# EasyEDA Pro project ProPrj_CyMouse.epro, board 主板
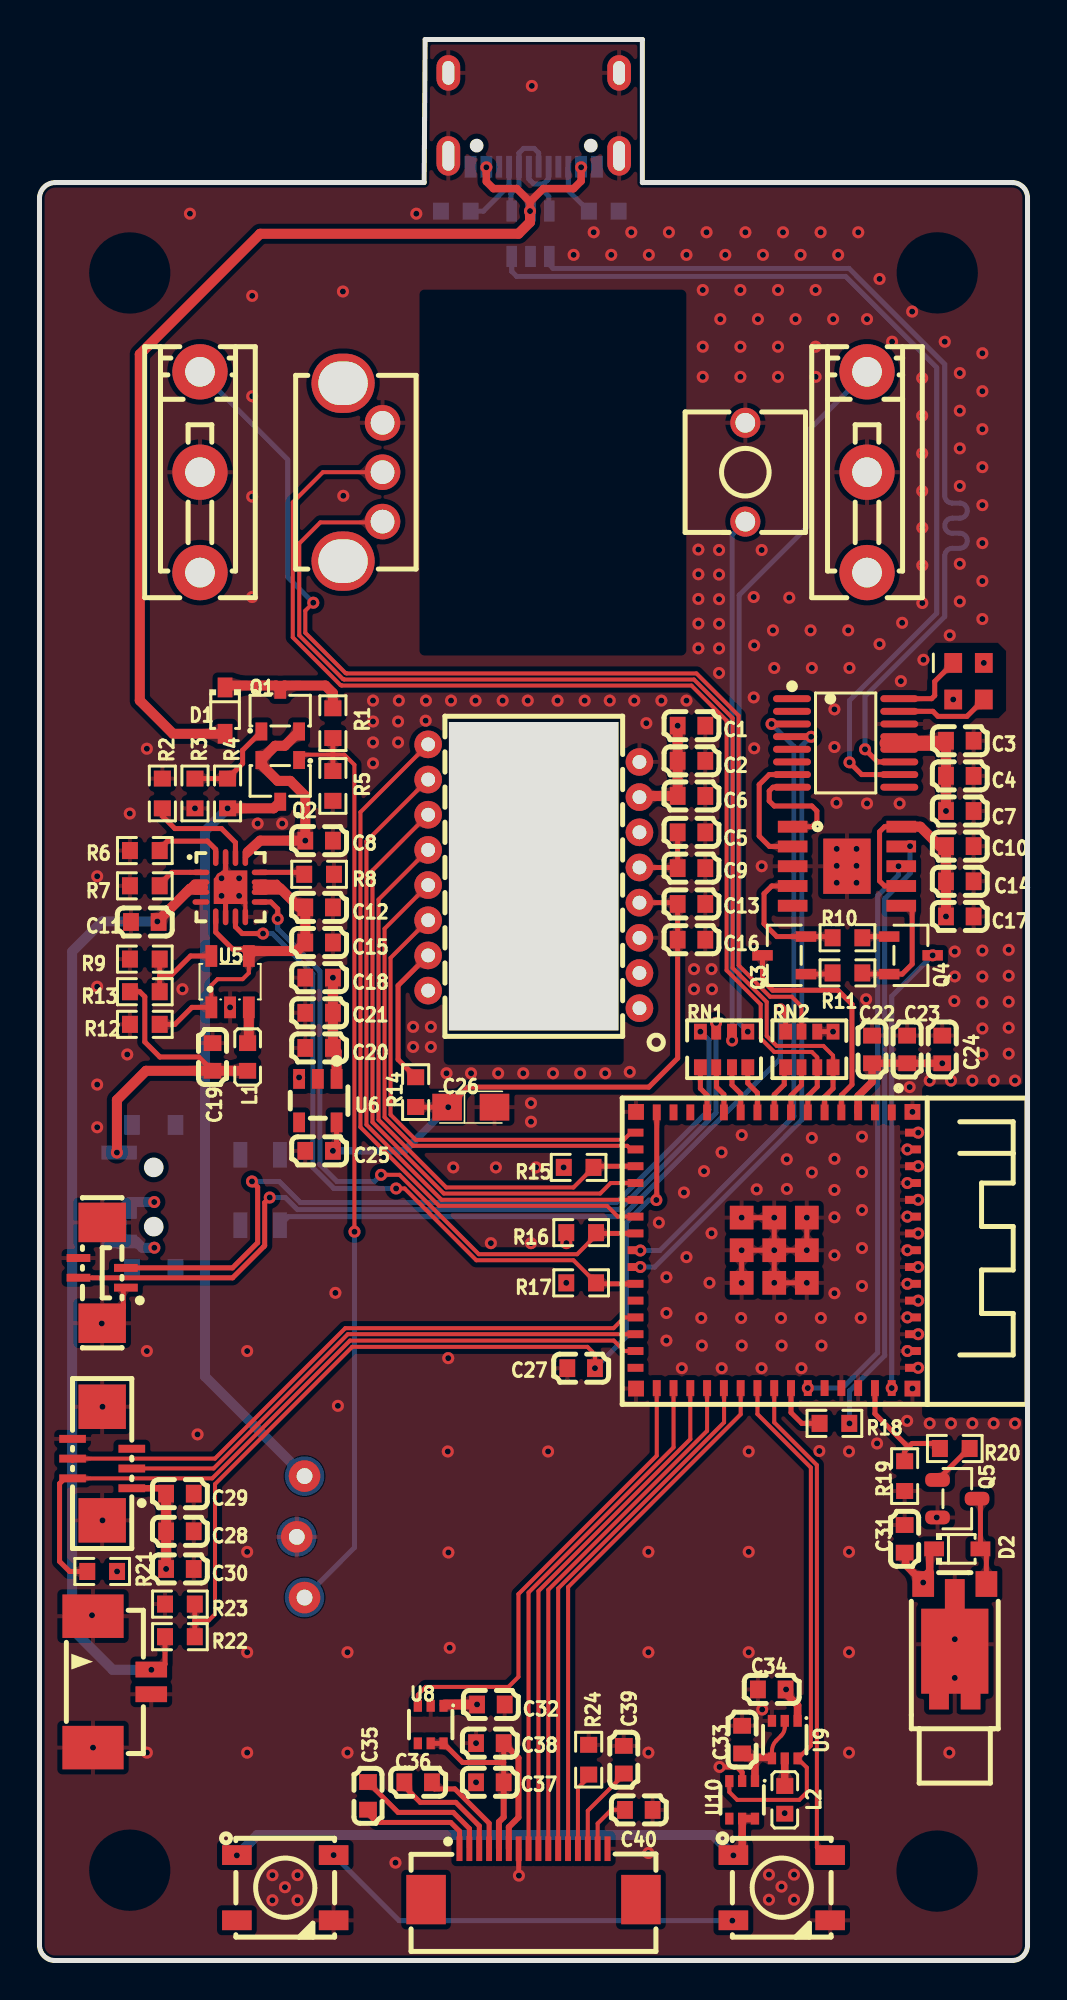
[diagram p7: board, top side]
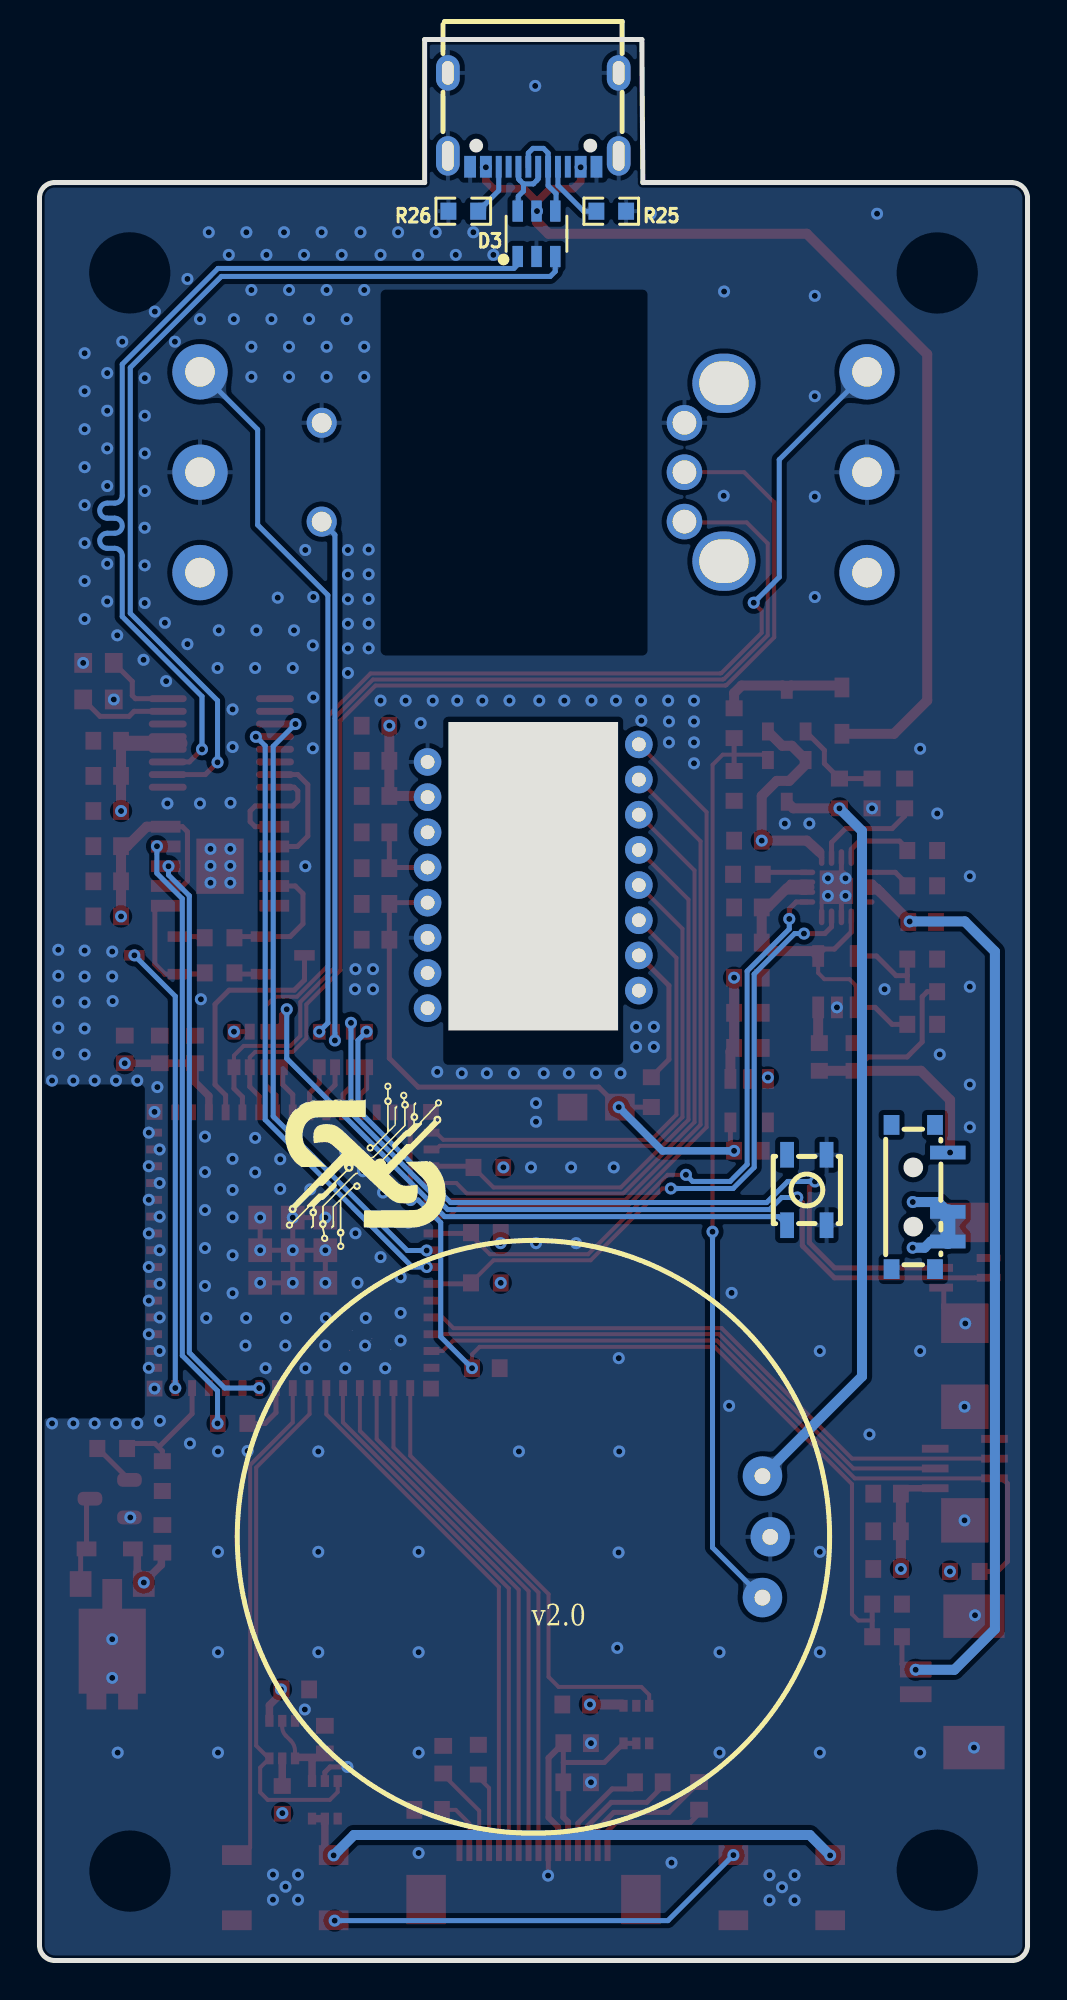
[diagram p8: board, bottom side, seen from below]

Outline 50.04 x 97.21 mm; copper layers: Top Layer, Inner1, Inner2, Bottom Layer. Coordinates in mm from the lower left corner of the outline.
Outline path: 0,89.2 arc(0.24,89.74) 0.79,89.97 19.48,89.97 19.53,97.21 30.53,97.21 30.53,89.97 49.28,89.97 arc(49.81,89.74) 50.04,89.2 50.04,0.76 arc(49.81,0.22) 49.27,0 0.78,0 arc(0.23,0.22) 0,0.76 0,89.2
Stack: Top Layer 0.035mm 外层铜厚1oz / Dielectric1 0.2104mm 7628 RC49% 8.6mil / Inner1 0.0152mm 内层铜厚 / Dielectric2 1.065mm 1.1mm H/HOZ Copper / Inner2 0.0152mm 内层铜厚 / Dielectric3 0.2104mm 7628 RC49% 8.6mil / Bottom Layer 0.035mm 外层铜厚1oz

## Design rules (mm)
net UD+: USB_PORT
net UD-: USB_PORT
net USB_D+: USB_MCU
net USB_D-: USB_MCU
net D3+: D3
net D3-: D3
template: 自定义配置
spacing copperThickness1oz (default): track to track 0.102, other pairs 0.152 to 0.3
spacing copperThickness2oz: track to track 0.203, other pairs 0.152 to 0.3
track width copperThickness1oz (default): min 0.127, default 0.254, max 2.54
track width copperThickness2oz: min 0.203, default 0.254, max 2.54
differential pair differentialPair (default): width min 0.127, default 0.254, max 2.54; gap min 0.152, default 0.152
via viaSize (default): diameter min 0.5, default 0.61, max 10; hole min 0.3, default 0.305, max 6.3

## Placement (name value [footprint] x y rotation side)
C1  10uF  [C0603]  33.02 62.48 180 top
C2  1uF  [C0603]  33.02 60.71 180 top
C3  100nF  [C0603]  46.61 61.72 0 top
C4  1uF  [C0603]  46.61 59.94 0 top
C5  4.7uF  [C0603]  33.02 57.08 180 top
C6  100nF  [C0603]  33.02 58.93 180 top
C7  10uF  [C0603]  46.61 58.17 0 top
C8  1uF  [C0603]  14.16 56.67 0 top
C9  100nF  [C0603]  33.02 55.27 180 top
C10  100nF  [C0603]  46.61 56.39 0 top
C11  4.7uF  [C0603]  5.33 52.55 0 top
C12  4.7uF  [C0603]  14.16 53.29 180 top
C13  100nF  [C0603]  33.02 53.46 180 top
C14  1uF  [C0603]  46.61 54.61 0 top
C15  4.7uF  [C0603]  14.16 51.51 180 top
C16  10uF  [C0603]  33.02 51.65 180 top
C17  10uF  [C0603]  46.61 52.83 0 top
C18  10uF  [C0603]  14.16 49.73 0 top
C19  10uF  [C0603]  8.76 45.72 270 top
C20  100nF  [C0603]  14.16 46.18 0 top
C21  1uF  [C0603]  14.16 47.95 0 top
C22  100nF  [C0603]  42.16 46.1 270 top
C23  1uF  [C0603]  43.94 46.1 270 top
C24  10uF  [C0603]  45.72 46.1 270 top
C25  1uF  [C0603]  14.16 40.97 0 top
C26  47uF  [CASE-A_3216]  21.84 43.18 0 top
C27  100nF  [C0603]  27.43 29.97 0 top
C28  1uF  [C0603]  7.11 21.72 180 top
C29  100nF  [C0603]  7.11 23.62 180 top
C30  10uF  [C0603]  7.11 19.81 180 top
C31  100nF  [C0603]  43.81 21.34 90 top
C32  1uF  [C0603]  22.86 12.95 180 top
C33  10uF  [C0603]  35.59 11.18 270 top
C34  10uF  [C0603]  37.08 13.72 0 top
C35  1uF  [C0603]  16.64 8.33 270 top
C36  1uF  [C0603]  19.18 9.02 180 top
C37  1uF  [C0603]  22.81 9.02 0 top
C38  1uF  [C0603]  22.81 11 0 top
C39  4.7uF  [C0603]  29.59 10.16 270 top
C40  4.7uF  [C0603]  30.35 7.62 180 top
CN1  WAFER-MX1.25-2PLB  [CONN-SMD_P1.25_M1250VS-02P]  4.19 14.1 270 top
D1  CUS10S30,H3F  [SOD-323_L1.8-W1.3-LS2.5-RD]  9.4 63.25 270 top
D2  CUS10S30,H3F  [SOD-323_L1.8-W1.3-LS2.5-RD]  46.48 20.83 0 top
D3  USBLC6-2SC6  [SOT-23-6_L2.9-W1.6-P0.95-LS2.8-BL]  24.87 87.38 180 bottom
DPI1  TS3315A  [SW-SMD_4P-L3.4-W3.4-P2.00-LS4.0]  11.18 38.99 270 bottom
FPC1  X05C2004TZ-518  [FPC-SMD_4P-P0.50_X05C2004TZ]  3.18 34.8 90 top
FPC2  AFC11-S06ICA-00  [FPC-SMD_6P-P0.50_AFC11-S06ICA-00]  3.18 25.15 90 top
FPC3  FPC-05F-16PH20  [FPC-SMD_16P-P0.50_FPC-05F-16PH20]  25.02 4.37 0 top
L1  2.2uH  [L0603]  10.54 45.72 90 top
L2  4.7uH  [L0603]  37.74 8.13 90 top
LED1  WS2812B-B/T  [LED-SMD_4P-L5.0-W5.0-TL_WS2812B-B]  12.45 3.68 0 top
LED2  WS2812B-B/T  [LED-SMD_4P-L5.0-W5.0-TL_WS2812B-B]  37.59 3.68 0 top
M1  Z3OC1T8219731  [VIBRATING-MOTOR-SMD_3P-C9900001680]  46.36 17.53 90 top
NOREF  -  [Pad_e18789]  13.42 24.51 0 top
NOREF#2  -  [Pad_e18779]  13.03 21.44 0 top
NOREF#3  -  [Pad_e18788]  13.42 18.36 0 top
Q1  AO3401  [SOT-23-3_L2.9-W1.4-P1.90-LS2.6-BR]  12.19 63.25 270 top
Q2  AO3401  [SOT-23-3_L2.9-W1.4-P1.90-LS2.6-BR]  12.19 59.69 90 top
Q3  S8050 J3Y(RANGE:200-350)  [SOT-23-3_L3.0-W1.7-P0.95-LS2.9-BR]  37.72 50.86 0 top
Q4  S8050 J3Y(RANGE:200-350)  [SOT-23-3_L3.0-W1.7-P0.95-LS2.9-BR]  44.13 50.86 180 top
Q5  AO3400A  [SOT-23-3_L2.9-W1.3-P1.90-LS2.4-BR]  46.48 23.37 180 top
R1  5.1kΩ  [R0603]  14.86 62.61 90 top
R2  47kΩ  [R0603]  6.22 59.05 270 top
R3  100kΩ  [R0603]  7.87 59.05 90 top
R4  5.1kΩ  [R0603]  9.53 59.05 270 top
R5  100kΩ  [R0603]  14.86 59.44 90 top
R6  1.2kΩ  [R0603]  5.33 56.17 180 top
R7  10kΩ  [R0603]  5.33 54.38 0 top
R8  1.2kΩ  [R0603]  14.16 54.96 180 top
R9  100kΩ  [R0603]  5.33 50.67 0 top
R10  4.7kΩ  [R0603]  40.92 51.75 0 top
R11  4.7kΩ  [R0603]  40.92 49.97 180 top
R12  499kΩ  [R0603]  5.33 47.37 0 top
R13  453kΩ  [R0603]  5.33 49.02 180 top
R14  5.6Ω  [R0603]  19.05 43.94 270 top
R15  10kΩ  [R0603]  27.31 40.13 180 top
R16  10kΩ  [R0603]  27.43 36.83 0 top
R17  10kΩ  [R0603]  27.43 34.29 0 top
R18  470Ω  [R0603]  40.26 27.18 180 top
R19  100kΩ  [R0603]  43.81 24.51 90 top
R20  470Ω  [R0603]  46.36 25.91 0 top
R21  100kΩ  [R0603]  3.18 19.69 180 top
R22  300kΩ  [R0603]  7.11 16.38 180 top
R23  300kΩ  [R0603]  7.11 18.03 0 top
R24  390kΩ  [R0603]  27.81 10.16 270 top
R25  5.1kΩ  [R0603]  21.08 88.52 180 bottom
R26  5.1kΩ  [R0603]  28.58 88.52 0 bottom
RN1  10kΩ  [RES-ARRAY-SMD_0603-8P-L3.2-W1.6-BL]  34.67 46.1 0 top
RN2  10kΩ  [RES-ARRAY-SMD_0603-8P-L3.2-W1.6-BL]  38.99 46.1 0 top
SW1  K9-1267T  [SW-TH_K9-1267T]  8.13 75.31 90 top
SW2  EC10E1220501  [SW-TH_EC10EXXXXXXX]  16.37 75.31 90 top
SW3  CMI621101D01  [SW-TH_L6.2-W6.2-P5.00]  35.75 75.31 270 top
SW4  K9-1267T  [SW-TH_K9-1267T]  41.91 75.31 90 top
TP1  -  [Test-Point-0.5mm]  13.42 24.51 0 top
TP2  -  [Test-Point-0.5mm]  13.03 21.44 0 top
TP3  -  [Test-Point-0.5mm]  13.42 18.36 0 top
U1  CH334R  [QSOP-16_L4.9-W3.9-P0.64-LS6.0-BL]  40.83 61.61 270 top
U2  BQ24073RGTR  [QFN-16_L3.0-W3.0-P0.50-TL-EP1.7]  9.68 54.31 0 top
U3  PAW3395DM-T6QU  [DIP-16_PAW3395DM-T6QU]  25.03 54.86 180 top
U4  CH340K  [ESOP-10_L4.9-W3.9-P1.00-LS6.2-BL-EP]  40.89 55.37 270 top
U5  TLV62569DBVR  [SOT-23-5_L3.0-W1.7-P0.95-LS2.8-BR]  9.65 49.53 270 top
U6  TLV70019DDCR  [SOT-23-5_L2.9-W1.6-P0.95-LS2.8-BR]  14.1 43.51 90 top
U7  ESP32-S3-MINI-1-N4R2  [BULETM-SMD_ESP32-S3-MINI-1-N8]  37.21 35.94 270 top
U8  TPS22919QDCKRQ1  [SC-70-6_L2.0-W1.3-P0.65-LS2.1-BR]  19.81 11.94 90 top
U9  TPS61222DCKR  [SC-70-6_L2.2-W1.3-P0.65-LS2.1-BR]  37.74 11.18 90 top
U10  TPS22919QDCKRQ1  [SC-70-6_L2.0-W1.3-P0.65-LS2.1-BR]  35.59 8.13 90 top
U11  MSS12C02LS-BB2.0  [SW-SMD_MSS12C02LS-HB2.0-1]  5.46 38.63 90 bottom
USB1  TYPE-C 16PIN 2MD(073)  [USB-C-SMD_TYPE-C-6PIN-2MD-073]  25.03 93.14 0 bottom
X1  12MHz  [CRYSTAL-SMD_4P-L2.5-W2.0-BL-A]  47.05 64.73 270 top

## Footprints (pads in the part's own frame, mm; a bottom-side part is the same pattern mirrored in y, then rotated)
BULETM-SMD_ESP32-S3-MINI-1-N8
  rect 0.8x0.4 smd: 1(-6.975,5.95) 2(-6.975,5.1) 3(-6.975,4.25) 4(-6.975,3.4) 5(-6.975,2.55) 6(-6.975,1.7) 7(-6.975,0.85) 8(-6.975,0) 9(-6.975,-0.85) 10(-6.975,-1.7) 11(-6.975,-2.55) 12(-6.975,-3.4) 13(-6.975,-4.25) 14(-6.975,-5.1) 15(-6.975,-5.95) 31(6.975,-5.95) 32(6.975,-5.1) 33(6.975,-4.25) 34(6.975,-3.4) 35(6.975,-2.55) 36(6.975,-1.7) 37(6.975,-0.85) 38(6.975,0) 39(6.975,0.85) 40(6.975,1.7) 41(6.975,2.55) 42(6.975,3.4) 43(6.975,4.25) 44(6.975,5.1) 45(6.975,5.95)
  rect 0.4x0.8 smd: 16(-5.95,-7.025) 17(-5.1,-7.025) 18(-4.25,-7.025) 19(-3.4,-7.025) 20(-2.55,-7.025) 21(-1.7,-7.025) 22(-0.85,-7.025) 23(0,-7.025) 24(0.85,-7.025) 25(1.7,-7.025) 26(2.55,-7.025) 27(3.4,-7.025) 28(4.25,-7.025) 29(5.1,-7.025) 30(5.95,-7.025) 46(5.95,7.025) 47(5.1,7.025) 48(4.25,7.025) 49(3.4,7.025) 50(2.55,7.025) 51(1.7,7.025) 52(0.85,7.025) 53(0,7.025) 54(-0.85,7.025) 55(-1.7,7.025) 56(-2.55,7.025) 57(-3.4,7.025) 58(-4.25,7.025) 59(-5.1,7.025) 60(-5.95,7.025)
  rect 0.8x0.8 smd: GND(-7,7) GND(-7,-7) GND(7,7) GND(7,-7)
  rect 1.2x1.2 smd: GND(-1.65,1.65) GND(-1.65,0) GND(-1.65,-1.65) GND(0,1.65) GND(0,0) GND(0,-1.65) GND(1.65,1.65) GND(1.65,0) GND(1.65,-1.65)
C0603
  rect 0.8x0.9 smd: 1(-0.7,0) 2(0.7,0)
CASE-A_3216
  rect 1.5x1.359 smd: 1(-1.2,0) 2(1.2,0)
CONN-SMD_P1.25_M1250VS-02P
  rect 0.8x1.6 smd: 1(-0.625,1.475) 2(0.625,1.475)
  rect 2.2x3.1 smd: 3(3.325,-1.475) 4(-3.325,-1.475)
CRYSTAL-SMD_4P-L2.5-W2.0-BL-A
  rect 1x0.9 smd: 1(-0.925,-0.775) 2(0.925,-0.775) 3(0.925,0.775) 4(-0.925,0.775)
DIP-16_PAW3395DM-T6QU
  round 1.4 hole 0.7: 1(-5.35,6.675) 2(-5.35,4.895) 3(-5.35,3.115) 4(-5.35,1.335) 5(-5.35,-0.445) 6(-5.35,-2.225) 7(-5.35,-4.005) 8(-5.35,-5.785) 9(5.35,-6.675) 10(5.35,-4.895) 11(5.35,-3.115) 12(5.35,-1.335) 13(5.35,0.445) 14(5.35,2.225) 15(5.35,4.005) 16(5.35,5.785)
ESOP-10_L4.9-W3.9-P1.00-LS6.2-BL-EP
  rect 0.6x1.5 smd: 1(-2,-2.75) 2(-1,-2.75) 3(0,-2.75) 4(1,-2.75) 5(2,-2.75) 6(2,2.75) 7(1,2.75) 8(0,2.75) 9(-1,2.75) 10(-2,2.75)
  rect 2.8x2.4 smd: 11(0,0)
FPC-SMD_4P-P0.50_X05C2004TZ
  rect 0.4x1.2 smd: 1(-0.75,-1.2) 2(-0.25,1.2) 3(0.25,-1.2) 4(0.75,1.2)
  rect 2x2.4 smd: 5(2.55,0) 6(-2.55,0)
FPC-SMD_6P-P0.50_AFC11-S06ICA-00
  rect 0.4x1.35 smd: 1(-1.25,-1.5) 2(-0.75,1.5) 3(-0.25,-1.5) 4(0.25,1.5) 5(0.75,-1.5) 6(1.25,1.5)
  rect 2.25x2.4 smd: 7(2.875,0) 8(-2.875,0)
FPC-SMD_16P-P0.50_FPC-05F-16PH20
  rect 0.3x1.25 smd: 1(-3.75,1.288) 2(-3.25,1.288) 3(-2.75,1.288) 4(-2.25,1.288) 5(-1.75,1.288) 6(-1.25,1.288) 7(-0.75,1.288) 8(-0.25,1.288) 9(0.25,1.288) 10(0.75,1.288) 11(1.25,1.288) 12(1.75,1.288) 13(2.25,1.288) 14(2.75,1.288) 15(3.25,1.288) 16(3.75,1.288)
  rect 2x2.5 smd: 17(5.44,-1.288) 18(-5.44,-1.288)
L0603
  rect 0.8x0.864 smd: 1(-0.7,0) 2(0.7,0)
LED-SMD_4P-L5.0-W5.0-TL_WS2812B-B
  rect 1.5x1 smd: 1(-2.45,1.65) 2(-2.45,-1.65) 3(2.45,-1.65) 4(2.45,1.65)
Pad_e18779
  round 1.6 hole 0.8: 1(0,0)
Pad_e18788
  round 1.6 hole 0.8: 1(0,0)
Pad_e18789
  round 1.6 hole 0.8: 1(0,0)
QFN-16_L3.0-W3.0-P0.50-TL-EP1.7
  oval 0.85x0.28 smd: 1(-1.5,0.75) 2(-1.5,0.25) 3(-1.5,-0.25) 4(-1.5,-0.75) 9(1.5,-0.75) 10(1.5,-0.25) 11(1.5,0.25) 12(1.5,0.75)
  oval 0.28x0.85 smd: 5(-0.75,-1.5) 6(-0.25,-1.5) 7(0.25,-1.5) 8(0.75,-1.5) 13(0.75,1.5) 14(0.25,1.5) 15(-0.25,1.5) 16(-0.75,1.5)
  custom 1.7x1.7 smd: 17(0,0)
QSOP-16_L4.9-W3.9-P0.64-LS6.0-BL
  oval 0.35x1.921 smd: 1(-2.24,-2.716) 2(-1.6,-2.716) 3(-0.96,-2.716) 4(-0.32,-2.716) 5(0.32,-2.716) 6(0.96,-2.716) 7(1.6,-2.716) 8(2.24,-2.716) 9(2.24,2.716) 10(1.6,2.716) 11(0.96,2.716) 12(0.32,2.716) 13(-0.32,2.716) 14(-0.96,2.716) 15(-1.6,2.716) 16(-2.24,2.716)
R0603
  rect 0.806x0.864 smd: 1(-0.753,0) 2(0.753,0)
RES-ARRAY-SMD_0603-8P-L3.2-W1.6-BL
  rect 0.65x0.8 smd: 1(-1.2,-0.9) 4(1.2,-0.9) 5(1.2,0.9) 8(-1.2,0.9)
  rect 0.5x0.8 smd: 2(-0.4,-0.9) 3(0.4,-0.9) 6(0.4,0.9) 7(-0.4,0.9)
SC-70-6_L2.0-W1.3-P0.65-LS2.1-BR
  rect 0.6x0.42 smd: 1(0.95,-0.65) 2(0.95,0) 3(0.95,0.65) 4(-0.95,0.65) 5(-0.95,0) 6(-0.95,-0.65)
SC-70-6_L2.2-W1.3-P0.65-LS2.1-BR
  rect 0.6x0.42 smd: 1(0.95,-0.65) 2(0.95,0) 3(0.95,0.65) 4(-0.95,0.65) 5(-0.95,0) 6(-0.95,-0.65)
SOD-323_L1.8-W1.3-LS2.5-RD
  rect 1x0.75 smd: 1(-1.173,0) 2(1.173,0)
SOT-23-3_L2.9-W1.3-P1.90-LS2.4-BR
  rrect 1.25x0.7 smd: 1(1,-0.95) 2(1,0.95) 3(-1,0)
SOT-23-3_L2.9-W1.4-P1.90-LS2.6-BR
  rect 0.91x0.6 smd: 1(1.055,-0.955) 2(1.055,0.955) 3(-1.055,0)
SOT-23-3_L3.0-W1.7-P0.95-LS2.9-BR
  rect 1.038x0.532 smd: 1(1.101,-0.95) 2(1.101,0.95) 3(-1.101,0)
SOT-23-5_L2.9-W1.6-P0.95-LS2.8-BR
  rect 1x0.6 smd: 1(1.1,-0.95) 2(1.1,0) 3(1.1,0.95) 4(-1.1,0.95) 5(-1.1,-0.95)
SOT-23-5_L3.0-W1.7-P0.95-LS2.8-BR
  rect 1.1x0.6 smd: 1(1.3,-0.95) 2(1.3,0) 3(1.3,0.95) 4(-1.3,0.95) 5(-1.3,-0.95)
SOT-23-6_L2.9-W1.6-P0.95-LS2.8-BL
  rect 0.532x1.072 smd: 1(-0.95,-1.149) 2(0,-1.149) 3(0.95,-1.149) 4(0.95,1.149) 5(0,1.149) 6(-0.95,1.149)
SW-SMD_4P-L3.4-W3.4-P2.00-LS4.0
  rect 1.3x0.7 smd: 1(-1.782,1) 2(1.782,1) 3(-1.782,-1) 4(1.782,-1)
SW-SMD_MSS12C02LS-HB2.0-1
  rect 0.7x1.8 smd: 1(-2.25,-1.425) 2(-0.75,-1.425) 3(2.25,-1.425)
  rect 1x0.8 smd: 4(-3.65,-0.775) 4(-3.65,1.425) 4(3.65,-0.775) 4(3.65,1.425)
SW-TH_EC10EXXXXXXX
  oval 3x3.2 hole 2.2x2.5: 4(-4.5,1) 5(4.5,1)
  round 1.8 hole 1.2: A(-2.5,-1) B(0,-1) C(2.5,-1)
SW-TH_K9-1267T
  round 2.8 hole 1.5: 1(-5.08,0) 2(0,0) 3(5.08,0)
SW-TH_L6.2-W6.2-P5.00
  round 1.524 hole 1: 1(-2.5,0) 2(2.5,0)
Test-Point-0.5mm
  round 2 smd far side: 1(0,0)
USB-C-SMD_TYPE-C-6PIN-2MD-073
  rect 0.6x1.1 smd: 1(-3.2,2.375) 2(-2.4,2.375) 11(2.4,2.375) 12(3.2,2.375)
  rect 0.3x1.1 smd: 3(-1.75,2.375) 4(-1.25,2.375) 5(-0.75,2.375) 6(-0.25,2.375) 7(0.25,2.375) 8(0.75,2.375) 9(1.25,2.375) 10(1.75,2.375)
  oval 1.2x1.8 hole 0.6x1.2: 13(-4.325,-2.375) 14(4.325,-2.375)
  oval 1.2x2 hole 0.6x1.5: 13(-4.325,1.825) 14(4.325,1.825)
VIBRATING-MOTOR-SMD_3P-C9900001680
  rect 1.3x1.1 smd: 1(1.525,1.6) 2(1.525,-1.6)
  custom 6.6x3.4 smd: 3(-1.525,0)

## Nets
As in the schematic, except:
GND: C1.1 C2.1 C3.2 C4.2 C5.1 C6.1 C7.2 C8.2 C9.1 C10.2 C11.1 C12.1 C13.1 C14.2 C15.1 C16.1 C17.2 C18.1 C19.1 C20.1 C21.1 C22.1 C23.1 C24.1 C25.1 C26.2 C27.1 C28.1 C29.1 C30.1 C31.2 C32.1 C33.1 C34.1 C37.1 C38.1 C39.1 C40.1 CN1.2 CN1.3 CN1.4 D3.2 DPI1.1 DPI1.2 FPC1.1 FPC1.4 FPC1.5 FPC1.6 FPC2.6 FPC2.7 FPC2.8 FPC3.7 FPC3.16 LED1.3 LED2.3 M1.3 NOREF#2.1 Q5.2 R2.1 R3.1 R5.1 R6.2 R7.1 R8.1 R9.1 R12.1 R19.1 R23.1 R24.1 R25.2 R26.2 SW1.2 SW2.C SW3.1 SW4.2 TP2.1 U1.14 U2.4 U2.6 U2.8 U2.15 U2.17 U3.3 U3.8 U4.3 U4.11 U5.2 U6.2 U7.1 U7.2 U7.42 U7.43 U7.46 U7.47 U7.48 U7.49 U7.50 U7.51 U7.52 U7.53 U7.54 U7.55 U7.56 U7.57 U7.58 U7.59 U7.60 U7.GND U8.2 U9.3 U10.2 USB1.1 USB1.12 USB1.13 USB1.14 X1.2 X1.4
NU1680_EN: NOREF#3.1 Q2.1 R1.1 R5.2 TP3.1
WBUS: NOREF.1 Q2.3 R4.2 TP1.1

Pads without a net: DPI1 3; FPC2 5; FPC3 17 18; LED1 2; SW1 1; SW2 4 5; SW4 1; U1 1 2 5 6 9; U3 1 2 6 16; U4 5; U6 4; U7 13 14 26 30 41; U8 4; U10 4; U11 4; USB1 3 9

## Via types
v1: diameter 0.61, hole 0.305, Top Layer to Bottom Layer, 372 vias

## Routing (per net, layer and track width the routed paths; a pad name or vN(x,y) marks a point on that pad's centre or on a via; arc(x,y) is an arc through that point)
1.9V: length 32.7
  Top Layer w0.254: v1(14.86,40.97) 15.05,41.16 U6.5 ; R14.2 19.06,43.18 v1(20.7,43.18) 21.72,44.2 30.86,44.2 32.32,45.65 C16.2 C13.2 32.26,53.53 30.05,53.53
  Bottom Layer w0.381: v1(14.86,40.97) 18.49,40.97 v1(20.7,43.18)
3V3: length 53.6
  Top Layer w0.254: R15.2 26.54,40.14 26.54,40.13 ; U4.10 42.8,57.37 42.55,57.12 42.55,54.63 42.8,54.37 U4.7 ; RN2.6 v1(40.19,47)
  Top Layer w0.33: 6.41,23.37 6.41,23.56 6.08,23.9 FPC2.1
  Top Layer w0.381: U7.3 41.46,43.75 42.16,44.45 C22.2 C23.2 v1(45.72,45.4) ; v1(37.81,13.72) 37.81,13.5 38.39,12.91 U9.1 ; 43.87,20.46 43.87,20.01 44.43,19.45 44.81,19.45 ; v1(44.75,19.12) 44.75,19.38 45.09,19.71 45.09,20.6 D2.1
  Top Layer w0.508: v1(45.91,52.83) C14.1 C10.1 45.59,56.39 44.61,57.37 U4.10 ; v1(32.32,62.48) C2.2 C6.2 30.44,58.93 U3.7 ; v1(6.41,19.81) C28.2 6.41,23.37 ; v1(22.16,12.95) 20.53,12.95 ; v1(45.91,58.17) C4.1 C3.1 ; v1(14.86,49.73) C21.2 C20.2 15.05,45.99 U6.1
  Top Layer w0.762: 42.93,61.59 45.78,61.59 C3.1
  Bottom Layer w0.508: U11.1 4.89,36.38 5.21,36.07 v1(5.82,36.07) ; U11.2 4.53,38.38 v1(5.81,38.38)
  Bottom Layer w0.762: U11.1 U11.2
  vias: v1(3.93,19.69) v1(13.15,44.68) v1(26.54,40.13) v1(26.68,36.3) v1(26.68,34.29) v1(37.74,7.46)
5V: length 19.9
  Top Layer w0.203: U5.1 8.7,49.34 9.02,49.66 10.29,49.66 10.6,49.97 U5.4
  Top Layer w0.254: 5.83,47.37 6.86,47.37 7.72,48.23 U5.1 ; U5.4 10.6,50.87 10.29,51.18 9.78,51.18 8.92,52.04 8.92,52.69 ; U2.11 12.04,54.56 12.28,54.32 ; U2.10 12.19,54.06
  Top Layer w0.508: 11.04,54.31 11.95,54.31 ; 10.78,51.08 13.03,51.08 C15.2 C12.2 ; 12.19,54.25 13.13,53.31 13.46,53.31 ; U5.4 10.78,51
GND: length 21
  Top Layer w0.203: 10.42,52.81 10.42,53.56
  Top Layer w0.254: 9.42,52.81 9.42,53.45 ; FPC3.7 24.27,4.31 v1(24.28,4.29) ; v1(37.21,35.94) v1(37.21,34.29) v1(38.86,34.29) ; v1(37.21,35.94) v1(37.21,37.59) v1(35.56,37.59) ; v1(37.21,35.94) v1(35.56,35.94) v1(35.56,34.29) ; v1(37.21,35.94) v1(38.86,35.94) v1(38.86,37.59) ; FPC1.6 3.42,32.25 4.19,33.02 ; 4.24,33.86 4.24,33.02 ; v1(9.22,54.76) 9.42,54.97 9.42,55.81 ; U10.2 35.59,9.53 35.32,9.79 v1(34.44,9.79)
  vias: v1(2.66,17.47) v1(2.71,10.77) v1(2.92,54.86) v1(2.92,49.28) v1(2.92,44.32) v1(2.92,42.16) v1(3.15,32.23) v1(3.19,28.02) v1(3.19,22.27) v1(4.44,45.85) v1(4.57,58.04) v1(5.44,61.32) v1(5.44,30.84) v1(5.44,10.52) v1(7.24,49.15) v1(7.62,88.39) v1(7.87,58.3) v1(8,26.62) v1(9.22,53.87) v1(9.65,48.23) v1(10.11,54.76) v1(10.11,53.87) v1(10.52,30.84) v1(10.52,20.68) v1(10.52,15.6) v1(10.52,10.52) v1(10.77,84.23) v1(10.77,79.15) v1(10.77,74.07) v1(10.77,68.99) v1(11.05,57.53) v1(11.8,4.32) v1(11.8,3.05) v1(12.29,57.53) v1(12.43,3.71) v1(13.07,4.32) v1(13.07,3.05) v1(14.99,33.78) v1(15.11,28.07) v1(15.37,84.45) v1(15.39,74.12) v1(15.6,15.6) v1(15.6,10.52) v1(16.89,63.75) v1(16.89,62.7) v1(16.89,61.64) v1(16.89,60.58) v1(18.03,4.95) v1(18.2,63.75) v1(18.16,62.7) v1(18.16,61.64) v1(18.92,47.24) v1(18.92,46.23) v1(19.08,88.39) v1(19.57,63.75) v1(19.56,62.74) v1(19.82,47.24) v1(19.82,46.23) v1(20.61,44.89) v1(20.7,30.48) v1(20.68,25.76) v1(20.71,20.65) v1(20.78,15.82) v1(20.84,63.75) v1(20.96,40.13) v1(21.86,44.89) v1(22.08,63.75) v1(22.11,11) v1(22.11,9.02) v1(22.86,36.3) v1(23.11,40.13) v1(23.23,44.89) v1(23.46,63.75) v1(24.5,44.89) v1(24.73,63.75) v1(24.89,43.38) v1(24.89,42.44) v1(24.89,36.3) v1(24.93,94.86) v1(25.15,40.13) v1(25.76,25.76) v1(26.01,44.89) v1(26.24,63.75) v1(27.05,86.31) v1(27.38,44.89) v1(27.61,63.75) v1(28.07,87.45) v1(28.65,44.89) v1(28.88,63.75) v1(28.96,86.31) v1(29.89,44.96) v1(29.97,87.45) v1(30.12,63.75) v1(30.73,62.61) v1(30.86,86.31) v1(30.84,20.68) v1(30.84,15.6) v1(30.84,10.52) v1(30.84,5.44) v1(31.37,37.34) v1(31.5,63.75) v1(31.75,34.58) v1(31.75,32.77) v1(31.75,31.37) v1(31.88,87.45) v1(32.53,29.97) v1(32.64,38.86) v1(32.77,86.31) v1(32.77,63.75) v1(32.77,35.59) v1(33.15,50.16) v1(33.15,49.15) v1(33.37,71.4) v1(33.37,70.15) v1(33.37,68.9) v1(33.37,67.65) v1(33.37,66.4) v1(33.52,32.51) v1(33.59,84.53) v1(33.59,81.66) v1(33.59,80.14) v1(33.55,31.11) v1(33.66,39.94) v1(33.78,87.45) v1(33.93,34.29) v1(34.04,50.16) v1(34.06,49.15) v1(34.04,36.8) v1(34.42,71.37) v1(34.42,70.13) v1(34.42,68.88) v1(34.42,67.64) v1(34.42,66.4) v1(34.42,65.15) v1(34.48,83.06) v1(34.54,40.89) v1(34.55,29.97) v1(34.73,86.31) v1(35.5,84.53) v1(35.5,81.66) v1(35.5,80.14) v1(35.57,41.77) v1(35.53,32.51) v1(35.57,31.11) v1(35.75,87.45) v1(35.92,25.76) v1(35.92,20.68) v1(35.92,15.6) v1(36.17,68.99) v1(36.19,66.55) v1(36.17,63.91) v1(36.19,61.34) v1(36.32,39.02) v1(36.39,83.06) v1(36.58,71.37) v1(36.58,55.37) v1(36.57,29.97) v1(36.6,12.7) v1(36.64,86.31) v1(36.94,4.34) v1(36.94,3.07) v1(37.15,67.31) v1(37.21,65.4) v1(37.4,84.53) v1(37.4,81.66) v1(37.4,80.14) v1(37.55,32.51) v1(37.59,31.11) v1(37.58,3.73) v1(37.66,87.45) v1(37.85,40.54) v1(37.85,39.04) v1(37.97,68.96) v1(38.21,4.34) v1(38.21,3.07) v1(38.29,83.06) v1(38.54,86.31) v1(38.59,29.97) v1(39.05,67.31) v1(39.12,65.4) v1(39.12,41.62) v1(39.12,39.88) v1(39.31,84.53) v1(39.31,81.66) v1(39.31,80.14) v1(39.5,25.78) v1(39.56,87.45) v1(39.57,32.51) v1(39.61,31.11) v1(40.2,83.06) v1(40.26,63.31) v1(40.26,61.4) v1(40.26,40.57) v1(40.26,38.99) v1(40.26,37.61) v1(40.26,35.69) v1(40.26,33.77) v1(40.36,58.58) v1(40.38,56.25) v1(40.38,55.39) v1(40.38,54.54) v1(40.45,86.31) v1(40.96,67.31) v1(41.02,65.4) v1(41,25.76) v1(41,20.68) v1(41,15.6) v1(41,10.52) v1(41.38,56.25) v1(41.38,55.39) v1(41.38,54.54) v1(41.47,87.45) v1(41.59,32.51) v1(41.66,41.69) v1(41.66,39.89) v1(41.66,37.97) v1(41.66,36.05) v1(41.66,34.13) v1(41.91,83.06) v1(41.91,58.55) v1(41.87,48.64) v1(42.42,26.16) v1(42.55,85.09) v1(42.55,66.61) v1(43.18,81.91) v1(43.56,58.55) v1(43.69,67.69) v1(43.62,64.74) v1(43.95,41.04) v1(43.95,39.34) v1(43.95,37.64) v1(43.95,35.94) v1(43.95,34.24) v1(43.95,32.54) v1(43.95,30.84) v1(43.94,27.3) v1(44.07,44.2) v1(44.2,83.44) v1(44.21,42.94) v1(44.21,28.94) v1(44.5,41.89) v1(44.5,40.19) v1(44.5,38.49) v1(44.5,36.79) v1(44.5,35.09) v1(44.5,33.39) v1(44.5,31.69) v1(44.5,29.99) v1(44.7,80.07) v1(44.7,78.17) v1(44.7,76.26) v1(44.7,74.36) v1(44.71,72.5) v1(44.71,70.6) v1(44.71,68.69) v1(44.77,65.82) v1(45.09,44.53) v1(45.09,27.18) v1(45.44,22.42) v1(45.85,81.91) v1(46.1,67.06) v1(46.08,10.52) v1(46.16,44.53) v1(46.16,27.18) v1(46.28,63.81) v1(46.36,51.05) v1(46.36,49.8) v1(46.33,48.55) v1(46.36,16.26) v1(46.36,14.3) v1(46.61,80.33) v1(46.61,78.42) v1(46.61,76.52) v1(46.61,74.61) v1(46.61,70.68) v1(46.61,68.77) v1(47.24,44.53) v1(47.24,27.18) v1(47.75,81.33) v1(47.75,79.41) v1(47.75,77.49) v1(47.75,75.57) v1(47.75,73.65) v1(47.75,71.72) v1(47.75,69.8) v1(47.75,67.88) v1(47.75,51.1) v1(47.75,49.79) v1(47.75,48.48) v1(47.75,47.16) v1(47.75,45.85) v1(47.83,65.66) v1(48.32,44.53) v1(48.32,27.18) v1(49.09,51.14) v1(49.09,49.83) v1(49.09,48.51) v1(49.09,47.2) v1(49.09,45.88) v1(49.4,44.53) v1(49.4,27.18)
VBAT: length 51.3
  Top Layer w0.254: R22.2 6.36,14.99 6.07,14.71 v1(5.67,14.71) ; U2.3 7.31,54.06 7.81,54.56 U2.2
  Top Layer w0.508: 7.76,54.31 8.28,54.31 ; 7.87,54.23 7.62,54.23 v1(5.97,52.58)
  Bottom Layer w0.508: v1(5.97,52.58) 3.18,52.58 1.65,51.05 1.65,16.76 3.71,14.71 v1(5.67,14.71)
VBUS: length 6.6
  Top Layer w0.508: D1.1 9.5,64.52 11.98,64.52 Q1.3 12.41,64.52 14.48,64.52 14.86,64.13 R1.2
BT_CHG: length 33.5
  Top Layer w0.203: R16.2 28.19,36.69 27.23,35.74 22.25,35.74 18.23,39.76 v1(17.3,39.76)
  Top Layer w0.254: R16.2 28.22,36.79 U7.22 ; U2.9 11.72,53.56 12.06,53.21 v1(12.06,52.7)
  Bottom Layer w0.254: v1(17.3,39.76) 16.96,39.42 15.06,39.42 14.2,40.28 14.2,50.06 12.06,52.2 v1(12.06,52.7)
BT_LV: length 46.9
  Top Layer w0.203: v1(28.13,29.97) 28.13,30.67 27.75,31.05 15.84,31.05 8.89,24.1 8.89,17.53 8.57,17.2 7.87,17.2
  Top Layer w0.254: R22.1 R23.2 ; U7.15 31.26,38.5 v1(31.24,38.48) ; 28.15,29.99 v1(28.13,29.97)
  Bottom Layer w0.254: v1(28.13,29.97) 29.72,31.56 29.72,37.34 30.86,38.48 v1(31.24,38.48)
BT_PGD: length 34
  Top Layer w0.203: R17.2 27.04,35.43 22.12,35.43 18.49,39.06 v1(18.06,39.06)
  Top Layer w0.254: R17.2 28.23,34.24 U7.25 ; v1(11.32,51.96) 10.27,51.96 9.92,52.31 9.92,52.81
  Bottom Layer w0.254: v1(18.06,39.06) 14.91,39.06 13.84,40.13 13.84,49.92 11.79,51.96 v1(11.32,51.96)
CHIP_PU: length 22.8
  Bottom Layer w0.254: v1(43.16,28.97) 43.16,48.79 v1(45.23,50.86)
D3+: length 6.2
  Top Layer w0.254: U1.8 37.15,59.37 36.96,59.18 36.96,58.67 37.21,58.42 39.12,58.42 39.37,58.17 39.37,57.63 39.12,57.37 U4.1
D3-: length 6.4
  Top Layer w0.254: U4.2 36.97,56.37 36.45,56.9 36.45,59.5 36.96,60.01 U1.7
DTR: length 6.9
  Top Layer w0.254: U4.4 37.08,54.37 36.69,53.98 36.69,52.46 37.34,51.81 Q3.2 40.11,51.81 R10.1
ENC_1: length 56.6
  Top Layer w0.203: 40.19,45.2 40.19,45.79 39.7,46.28 37.34,46.28 36.83,46.79 36.83,48.5 35.1,50.23 35.1,62.86 33.15,64.82 15.43,64.82 15.41,64.84 15.37,64.84 13.16,67.06 13.16,71.7 14.22,72.77 17.33,72.77 SW2.A
  Top Layer w0.254: U7.5 39.76,43.7 40.19,44.13 40.19,45.2
ENC_2: length 58.8
  Top Layer w0.203: SW2.B 14.35,75.31 12.83,73.79 12.83,66.95 15.25,64.54 15.28,64.54 15.3,64.52 33.02,64.52 34.8,62.74 34.8,50.1 36.53,48.38 36.53,46.66 37.21,45.97 39.12,45.97 39.39,45.7 39.39,45.2
  Top Layer w0.254: 39.39,45.2 39.39,44.21 38.91,43.74 U7.6
GPIO0: length 12
  Top Layer w0.254: Q3.3 36.62,49.62 37.13,49.1 40.44,49.1 41.15,48.39 41.15,44.32 40.61,43.79 U7.4
H_RST: length 37.4
  Top Layer w0.203: FPC2.2 8.75,24.4 15.72,31.37 29.08,31.37 29.61,30.84 U7.29
  Top Layer w0.254: 1.16,24.27 1.02,24.13 1.02,20.19 1.52,19.69 R21.2
H_URX: length 28.3
  Top Layer w0.203: FPC2.3 8.82,24.9 15.61,31.69 U7.28
H_UTX: length 31.5
  Top Layer w0.203: U7.27 29.62,32.54 29.08,32 15.49,32 8.89,25.4 FPC2.4 ; 1.68,25.27 1.68,25.27
MOTO: length 6.3
  Top Layer w0.254: U7.44 42.31,27.67 43.94,26.03 ; 43.81,25.01 43.81,25.78 44.2,26.16 45.6,26.16
MS_CS: length 26
  Top Layer w0.203: 19.68,54.42 17.47,52.21 17.47,42.67 18.92,41.22 29.77,41.22 29.95,41.04 U7.17
MS_MISO: length 29.6
  Top Layer w0.203: R15.1 27.04,39.12 20.6,39.12 17.17,42.55 17.17,53.68 U3.12
  Top Layer w0.254: R15.1 28.12,40.19 U7.18
MS_MOSI: length 31.8
  Top Layer w0.203: U3.11 16.86,55.16 16.86,42.42 20.47,38.81 28.4,38.81 28.93,39.34 U7.19
MS_MOTION: length 36.6
  Top Layer w0.203: U3.9 16.25,58.11 16.25,42.17 20.24,38.19 28.74,38.19 29.29,37.64 U7.21
MS_RES: length 23.7
  Top Layer w0.203: U7.16 29.95,41.89 29.59,41.53 19.05,41.53 17.78,42.8 17.78,50.73 U3.14 ; 19.35,52.63 19.35,52.64
MS_SCLK: length 34
  Top Layer w0.203: U3.10 16.56,56.63 16.56,42.29 20.36,38.49 U7.20
NU1680_EN: length 48
  Top Layer w0.203: v1(15.95,36.88) 15.95,36.88 15.95,60.5 15.44,61.02 13.42,61.02 Q2.1
  Top Layer w0.254: R1.1 R5.2
  Bottom Layer w0.254: NOREF#3.1 15.95,20.89 v1(15.95,36.88)
OLED_CS: length 26.4
  Top Layer w0.203: FPC3.8 24.77,18.62 32.11,25.96 U7.32
OLED_D/C: length 26.6
  Top Layer w0.203: FPC3.10 25.77,18.76 33.81,26.8 U7.34
OLED_PWD: length 23.5
  Top Layer w0.203: U8.3 19.16,13.45 19.56,13.84 23.75,13.84 24.26,14.35 24.26,18.54 31.26,25.55 U7.31
OLED_RES: length 26.5
  Top Layer w0.203: FPC3.9 25.27,18.69 32.96,26.38 U7.33
OLED_SCLK: length 26.8
  Top Layer w0.203: U7.35 34.67,28.96 34.67,27.23 26.27,18.83 FPC3.11
OLED_SDIN: length 26.9
  Top Layer w0.203: FPC3.12 26.77,5.66 26.77,18.9 35.51,27.64 35.51,28.97
PR_SW1: length 57.4
  Top Layer w0.203: v1(13.87,68.71) 13.46,68.3 13.46,67.18 15.5,65.15 15.53,65.15 15.55,65.13 33.27,65.13 35.41,62.99 35.41,50.36 37,48.77 38.1,48.77 38.59,48.28 RN2.7
  Bottom Layer w0.254: SW1.3 12.57,75.95 12.57,70 v1(13.87,68.71)
PR_SW2: length 36.3
  Bottom Layer w0.254: SW4.3 38.99,77.47 38.99,72.64 35.43,69.09 35.43,47.44 v1(35.87,47)
PR_SW3: length 27
  Top Layer w0.254: v1(35.08,46.55) 35.08,46.99 35.07,47
  Bottom Layer w0.254: SW3.2 35.08,72.14 v1(35.08,46.55)
PR_SW4: length 42.5
  Top Layer w0.203: 2.67,34.55 2.67,34.54 1.98,34.54 FPC1.2
  Top Layer w0.254: 2.67,34.54 9.78,34.54 11.35,36.12 11.35,36.12 11.41,36.17 11.41,38.35 v1(11.66,38.61) ; RN1.7 34.26,47.01 v1(34.26,47.45)
  Bottom Layer w0.254: v1(34.26,47.45) 34.26,42.9 29.37,38 13.06,38 12.45,38.61 v1(11.66,38.61)
PR_SW5: length 40.1
  Top Layer w0.254: v1(10.76,39.42) 11.05,39.13 11.05,36.32 9.78,35.05 FPC1.3
  Bottom Layer w0.254: v1(33.47,47) 33.91,46.56 33.91,43.04 29.22,38.35 13.21,38.35 12.14,39.42 v1(10.76,39.42)
PR_SW_DPI: length 32.6
  Top Layer w0.254: RN2.8 37.79,47.86 v1(37.52,48.13)
  Bottom Layer w0.254: v1(37.52,48.13) 37.52,45.64 29.51,37.64 12.61,37.64 DPI1.4
RGB_LED: length 25
  Top Layer w0.203: LED2.4 39.75,5.33 39.37,5.71 39.37,25.07 37.21,27.23 U7.38
RGB_PWD: length 26.8
  Top Layer w0.203: 38.42,10.23 39.06,10.87 39.06,24.94 36.36,27.65 U7.37 ; U9.6 38.86,9.76 38.86,8.51 38.48,8.13 35.33,8.13 34.94,8.52 U10.3
RTS: length 6.1
  Top Layer w0.254: R11.1 41.73,49.91 Q4.2 43.69,49.91 44.2,50.42 44.2,53.12 43.94,53.37 U4.6
SW1: length 2.5
  Top Layer w0.254: U7.7 38.06,43.78 38.59,44.3 38.59,45.2
SW2: length 2.5
  Top Layer w0.254: 35.87,45.2 35.87,44.39 36.36,43.9 U7.9
SW3: length 2.5
  Top Layer w0.254: 35.07,45.2 35.07,44.3 35.51,43.86 35.51,42.92
SW4: length 2.4
  Top Layer w0.254: U7.11 34.66,43.82 34.29,44.2 34.29,45.18 34.27,45.2
SW5: length 2.4
  Top Layer w0.254: 33.47,45.2 33.47,44.13 33.81,43.79 U7.12
SW_3V3: length 17.1
  Top Layer w0.254: C19.2 8.06,45.72 6.1,45.72 5.33,46.48 5.33,48.77 5.08,49.02 R13.2
  Top Layer w0.508: L1.1 C19.2 5.4,45.02 3.92,43.54 v1(3.92,40.88)
SW_DPI: length 2.5
  Top Layer w0.254: U7.8 37.21,43.81 37.72,44.32 37.72,45.13 37.79,45.2
U0RX: length 29.3
  Bottom Layer w0.254: v1(43.5,55.37) 43.5,54.93 42.45,53.88 42.45,30.76 40.66,28.97 v1(38.91,28.97)
U0TX: length 2.9
  Top Layer w0.254: U7.39 38.06,27.72 38.61,27.18 R18.2
UD+: length 48.9
  Top Layer w0.254: v1(41.81,61.29) 42.45,60.65 43.54,60.65
  Bottom Layer w0.254: D3.1 25.82,85.82 26.01,85.62 41,85.62 45.85,80.77 45.85,74.13 arc(45.96,73.86) 46.23,73.75 46.61,73.75 arc(46.99,73.37) 46.61,72.98 46.23,72.98 arc(45.85,72.6) 46.23,72.22 46.61,72.22 arc(46.99,71.84) 46.61,71.46 46.23,71.46 arc(45.96,71.35) 45.85,71.08 45.85,68.01 41.81,63.97 v1(41.81,61.29)
UD-: length 48.9
  Top Layer w0.254: 43.54,60.01 41.64,60.01 v1(41.02,60.63)
  Bottom Layer w0.254: v1(41.02,60.63) 41.02,63.75 45.44,68.17 45.44,80.6 40.83,85.22 24.17,85.22 23.92,85.47 D3.3
USB_D+: length 30.9
  Bottom Layer w0.254: v1(39.08,61.92) 39.06,61.92 38.61,61.47 38.61,42.54 31.15,35.09 v1(30.43,35.09)
USB_D-: length 30.9
  Bottom Layer w0.254: v1(37.07,62.57) 38.2,61.44 38.2,42.71 31.42,35.93 v1(30.43,35.93)
VOUT: length 11.4
  Top Layer w0.254: 10.42,55.81 10.8,56.18 10.8,56.26
  Top Layer w0.508: 10.55,56.1 11.18,56.67 v1(13.46,56.67) 13.46,58.93 12.7,59.69 12.06,59.69 11.24,60.52 ; Q1.2 12.42,61.47 11.94,61.47 11.24,60.77 Q2.2
WBUS: length 39.2
  Top Layer w0.508: v1(9.53,58.3) 11.86,58.3 Q2.3
  Bottom Layer w0.508: NOREF.1 8.38,29.55 8.38,57.16 v1(9.53,58.3)
XIN: length 3.9
  Top Layer w0.254: X1.1 45.34,64.72 45.34,64.01 45.18,63.85 43.54,63.85
XOUT: length 4.7
  Top Layer w0.254: X1.3 46.97,62.96 45.5,62.96 45.25,63.21 43.54,63.21
$1N3031: length 2.7
  Bottom Layer w0.254: 26.78,90.74 26.78,89.56 R26.1
$1N3032: length 3.4
  Bottom Layer w0.254: 23.78,90.74 23.78,89.82 22.48,88.52 R25.1
$1N3042: length 3.9
  Bottom Layer w0.254: 25.79,88.52 25.79,89.27 25.53,89.54 25.53,89.9 ; 25.53,89.9 25.54,89.91 25.55,89.91 25.71,90.08 25.71,90.08 25.78,90.15 25.78,90.74 ; 25.53,89.9 25.03,89.9 25.02,89.91 25.02,89.91 24.85,90.08 24.85,90.08 24.78,90.15 24.78,90.74
$1N3043: length 4.8
  Bottom Layer w0.254: 23.88,88.72 23.88,89.41 24.28,89.81 USB1.5 24.28,91.46 24.52,91.7 25.05,91.7 25.28,91.46 25.28,90.74
$1N3045: length 53.2
  Top Layer w0.381: 24.84,88.99 v1(24.84,88.52) ; 24.84,88.99 25.51,89.66 27.05,89.66 27.43,90.04 v1(27.43,90.74) ; 24.84,88.99 24.17,89.66 22.99,89.66 22.63,90.02 v1(22.63,90.74)
  Top Layer w0.508: D1.2 6.76,62.07 5.08,63.76 5.08,81.28 11.18,87.38 24.26,87.38 24.84,87.96 v1(24.84,88.52)
$1N5320: length 1.4
  Top Layer w0.254: Q4.1 41.73,51.81 R10.2
$1N5321: length 1.4
  Top Layer w0.254: Q3.1 40.11,49.91 R11.2
$1N5356: length 30.5
  Bottom Layer w0.254: v1(41.02,27.18) 41.02,28.82 42.81,30.61 42.81,53.73 44.09,55.02 44.09,56.38 v1(44.09,56.39)
$1N6254: length 4.5
  Top Layer w0.254: Q5.3 47.65,23.2 D2.2 47.96,20.53 M1.2
$1N7553: length 4
  Top Layer w0.254: 32.32,56.96 C9.2 32.29,55.31 30.05,55.31
$1N7571: length 7.2
  Top Layer w0.254: R14.1 19.05,44.7 18.16,45.59 18.16,49.34 U3.15
$1N60166: length 4.7
  Top Layer w0.254: Q1.1 10.29,61.24 10.29,60.57 R4.1 R3.2
$1N85866: length 5.8
  Top Layer w0.254: 21.27,5.73 21.27,6.54 20.83,6.98 17.08,6.98 16.64,7.43
$1N85867: length 7
  Top Layer w0.254: 21.77,5.73 21.77,6.68 20.96,7.49 18.16,7.49 16.83,8.83 16.64,8.83
$1N85868: length 4.9
  Top Layer w0.254: 19.88,8.81 20,8.68 21.04,8.68 22.77,6.95 22.77,5.73
$1N85869: length 5.7
  Top Layer w0.254: 22.27,5.73 22.27,6.81 21.08,8 19.28,8 18.48,8.81
$1N85880: length 2.9
  Top Layer w0.203: C40.2 28.96,7.62 28.27,6.93 FPC3.15
$1N85884: length 4.6
  Top Layer w0.203: FPC3.14 27.77,7.58 29.59,9.4 C39.2
$1N85933: length 4
  Top Layer w0.203: R24.2 27.81,9.27 27.27,8.73 FPC3.13
$1N130397: length 2.5
  Top Layer w0.254: 47.11,26.16 47.11,25.94 Q5.1
$1N147084: length 1.8
  Top Layer w0.508: U5.3 10.6,46.48 L1.2
$1N147367: length 4.7
  Top Layer w0.254: U5.5 7.65,50.83 6.66,49.83 6.09,49.83 ; 6.09,49.83 R9.2 ; 6.09,49.83 R13.1
$1N156146: length 2.3
  Top Layer w0.254: U2.12 13.23,55.06 13.41,54.89
$1N190580: length 21.6
  Bottom Layer w0.254: 35.09,2.02 18.21,2.02 v1(14.9,5.33)
  vias: v1(35.09,2.02)
$1N282636: length 15.4
  Top Layer w0.254: 23.51,10.02 23.51,9.02 ; 23.51,10.02 23.51,11 ; 23.51,10.02 21.43,10.02 U8.6 U8.5
  Top Layer w0.305: 23.51,9.02 23.51,7.25 23.27,7.01 FPC3.5 ; 23.51,11 24.26,10.25 24.26,7.24 23.77,6.75 FPC3.6
$1N290073: length 5
  Top Layer w0.203: 37.1,10.3 37.1,10.6 arc(37.15,10.89) 37.31,11.13 37.57,11.38 arc(37.7,11.58) 37.75,11.81 37.75,12.2
  Top Layer w0.381: 37.09,10.28 35.71,10.28 35.46,10.53 ; 36.15,10.23 36.24,10.14 U10.1
$1N290075: length 1.4
  Top Layer w0.381: L2.2 U9.5
$1N290162: length 28.7
  Top Layer w0.381: U10.6 U10.5 35.59,5.78 LED2.1
  Bottom Layer w0.508: v1(35.14,5.32) 34.11,6.35 11.03,6.35 v1(10,5.32)
$1N342149: length 3.7
  Top Layer w0.254: 8.92,55.81 8.92,56.23 8.51,56.64 6.48,56.64 6,56.17
$1N342151: length 5.4
  Top Layer w0.254: 9.92,55.81 9.92,56.57 9.22,57.28 6.86,57.28 6.22,57.91 R2.2
$1N342153: length 2.6
  Top Layer w0.254: 5.83,54.46 6.09,54.46 6.69,55.06 U2.1

## Copper pours and planes (outline as drawn; the poured copper is in the pictures)
3V3 on Inner2: 0,97.15 50.17,97.15 50.17,-0.13 0,-0.13
GND on Top Layer: 0,97.28 50.04,97.28 50.04,0 0,0
GND on Bottom Layer: 0,97.28 50.04,97.28 50.04,0 0,0
GND on Inner1: 0,97.15 50.04,97.15 50.04,0 0,0

Small or netless copper shapes (teardrops, artwork), in the pictures only: 319 on Top Layer, 48 on Bottom Layer

## Text on the board
Bottom Silkscreen Layer: v2.0
